# Altium schematic sheet AFE4220.SchDoc: Sensor BIO
size A4; CompanyName: MUISE; Engineer: Manuel Viqueira Rodríguez; Organization: ETSI Telecomunicaciones; Address1: Av. Complutense, 30; Address2: , 28040 Madrid; Address3: Madrid; Address4: España; DocumentNumber: 2; Revision: V1.0; SheetNumber: 2; SheetTotal: 8; Engineer2: Marcos Vazquez Nuñez
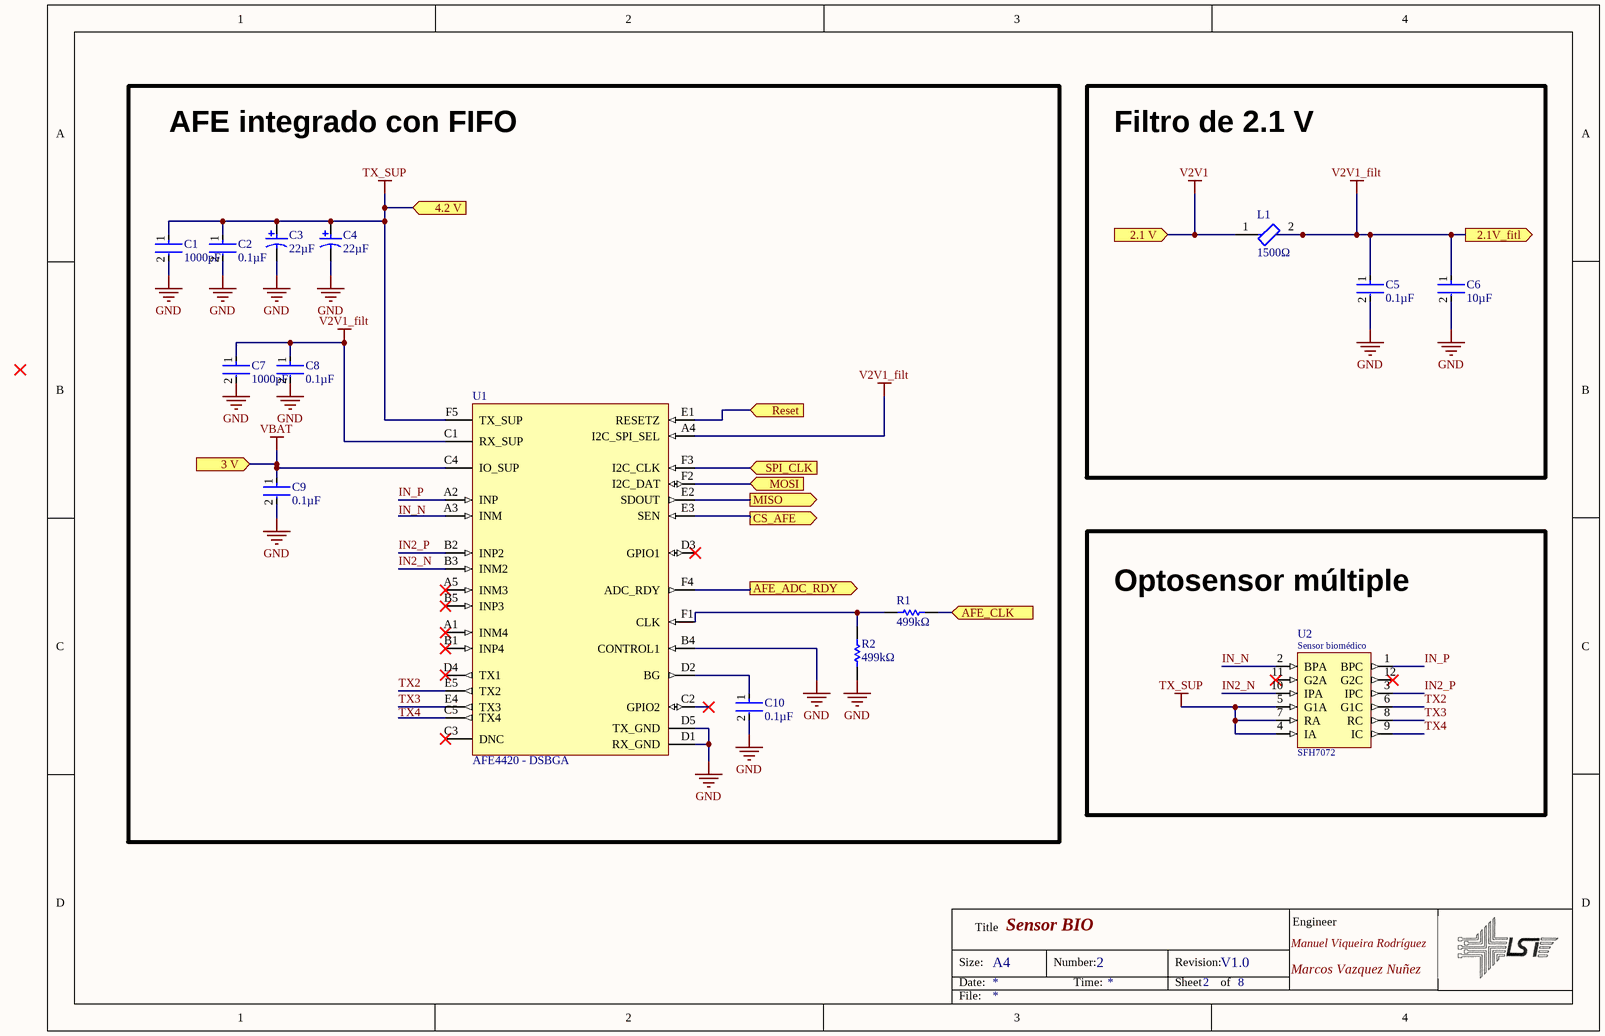
[diagram p0: AFE4220.SchDoc]

## Parts
C1  1000pF  [FP-CL10-IPC_B]
C2  0.1µF  [FP-CL10-IPC_B]
C3  22µF  [NIC-CAPA2-4X5.8_V]
C4  22µF  [NIC-CAPA2-4X5.8_V]
C5  0.1µF  [FP-CL10-IPC_B]
C6  10µF  [FP-CL10-IPC_B]
C7  1000pF  [FP-CL10-IPC_B]
C8  0.1µF  [FP-CL10-IPC_B]
C9  0.1µF  [FP-CL10-IPC_B]
C10  0.1µF  [FP-CL10-IPC_B]
L1  1500Ω  [FP-BLM18-0_15-t0_8-IPC_C]
R1  499kΩ  [RESC1005X40X25NL05T10]
R2  499kΩ  [RESC1005X40X25NL05T10]
U1  AFE4420 - DSBGA  [AFE4420 - DSBGA]
U2  (no value)  [SFH7072]

## Blocks framed on the sheet
AFE integrado con FIFO: C1-C4 C7-C10 R1 R2 U1
Filtro de 2.1 V: C5 C6 L1
Optosensor múltiple: U2

## Ports
2.1 V (in), 2.1V_fitl (out), 3 V (in), 4.2 V (in), AFE_ADC_RDY (out), AFE_CLK (in), CS_AFE (out), MISO (out), MOSI (in), Reset (in), SPI_CLK (in)

## Nets
GND: C1.2 C2.2 C3.2 C4.2 C5.2 C6.2 C7.2 C8.2 C9.2 C10.2 R2.1 U1.B4(CONTROL1) U1.D1(RX_GND) U1.D5(TX_GND)
TX_SUP: C1.1 C2.1 C3.1 C4.1 U1.F5(TX_SUP) U2.4(IA) U2.5(G1A) U2.7(RA) ; port 4.2 V
V2V1: L1.1 ; port 2.1 V
V2V1_filt: C5.1 C6.1 C7.1 C8.1 L1.2 U1.A4(I2C_SPI_SEL) U1.C1(RX_SUP) ; port 2.1V_fitl
VBAT: C9.1 U1.C4(IO_SUP) ; port 3 V
AFE_ADC_RDY: U1.F4(ADC_RDY) ; port AFE_ADC_RDY
AFE_CLK: R1.2 ; port AFE_CLK
CS_AFE: U1.E3(SEN) ; port CS_AFE
IN2_N: U1.B3(INM2) U2.10(IPA)
IN2_P: U1.B2(INP2) U2.3(IPC)
IN_N: U2.2(BPA)
IN_P: U1.A2(INP) U2.1(BPC)
MISO: U1.E2(SDOUT) ; port MISO
MOSI: U1.F2(I2C_DAT) ; port MOSI
Reset: U1.E1(RESETZ) ; port Reset
SPI_CLK: U1.F3(I2C_CLK) ; port SPI_CLK
TX2: U1.E5(TX2) U2.6(G1C)
TX3: U1.E4(TX3) U2.8(RC)
TX4: U2.9(IC)
NetC10_1: C10.1 U1.D2(BG)
NetR1_1: R1.1 R2.2 U1.F1(CLK)

Not connected (* = marked no-connect by the designer): U1 A1(INM4)* A3(INM) A5(INM3)* B1(INP4)* B5(INP3)* C2(GPIO2)* C3(DNC)* C5(TX4) D3(GPIO1)* D4(TX1)*; U2 11(G2A)* 12(G2C)*

## Notes on the sheet
- Labels drawn without touching a wire or pin: IN_N, TX4
- Size:
- Date:
- Title
- A4
- Number:
- Time:
- Revision:
- Sheet
- of
- Engineer
- File:
- (in symbol SFH7072) Sensor biomédico

## Library data of the parts
C1 C2 C5-C10 = CMP-13271-003245-1: Cap Ceramic 10uF 10V X5R ±10% Pad SMD 0603 +85°C T/R; Packaging: Tape and Reel; Dielectric: X5R; Min Operating Temperature: -55°C; Lead Free: Lead Free; Height: 0.8mm; Package Quantity: 10000; Voltage Rating (DC): 10V; Mount: Surface Mount; Tolerance: 10%; Width: 0.031inch; Thickness: 0.035inch; Depth: 0.8mm; Max Operating Temperature: 85°C; Capacitance: 10uF; Case/Package: 0603; Length: 1.6mm; Voltage Rating: 10V; Radiation Hardening: No
C3 C4 = CMP-0687-00010-1: Aluminum Electrolytic Capacitor, UD Series, Low Impedance, 22 uF, 10 V, + / - 20%, -55 to 105 degC, Chip Type, 4 x 5.8 mm D x L, Pb-Free, Reel; Manufacturer: Nichicon; PartNumber: UUD1A220MCL1GS; Endurance Time: 2000 h; Packing: Dia382mm Reel; Tolerance Rated Capacitance: -20 to 20%; Rated Ripple Current (at 100kHz): 80 mA; Impedance: 1.8 Ohm; Rated Capacitance: 22 uF; Rated Voltage: 10 V; ComponentLink3URL: http://products.nichicon.co.jp/en/pdf/XJA043/e-ud.pdf; ComponentLink2URL: http://products.nichicon.co.jp/en/pdf/XJA043/e-ud.pdf; ComponentLink2Description: Datasheet; ComponentLink1URL: http://www.nichicon.co.jp/; DatasheetVersion: 08/2012; PackageDescription: 2-Pin Surface Mount Device, Diameter 4 mm, Height 5.8 mm, Pitch 3.6 mm; PackageReference: CAPAE-D4H5.8; ComponentLink1Description: Manufacturer URL; Length: 5.8 mm; Diameter: 4 mm; ComponentLink3Description: Package Specification; Mounting Technology: Surface Mount; RoHS: TRUE
L1 = CMP-0686-00368-3: Chip Ferrite Bead, 0603, 1500Ω @ 100MHz, 0.5Ω, 25%, 500mA; Impedance: 1.5kR; DC Resistance (DCR): 500mR; Number of Circuits: 1; Test Frequency: 100MHz; Case/Package: 0603; Max Operating Temperature: 125°C; Package Quantity: 1; Max DC Current: 500mA; Tolerance: 25%; Core Material: Ferrite; Width: 0.8mm; Number of Pins: 2; Depth: 0.8mm; Radiation Hardening: No; Case Code (Imperial): 0603; Min Operating Temperature: -55°C; Termination: SMD/SMT; Material: Ferrite; Military Standard: Not; Number of Lines: 1; DC Current: 500mA; Length: 1.6mm; REACH SVHC: No SVHC; Lead Free: Lead Free; Current Rating: 500mA; Max Current Rating: 500mA; Packaging: Tape and Reel; Case Code (Metric): 1608; Height: 0.8mm
R1 R2 = CMP-2002-06462-1: Part Number: ERJ-U02F1501X; Manufacturer: Panasonic
U2 = SFH7072: Sensor biométrico